# Altium schematic sheet Prefreals.SchDoc
size A4
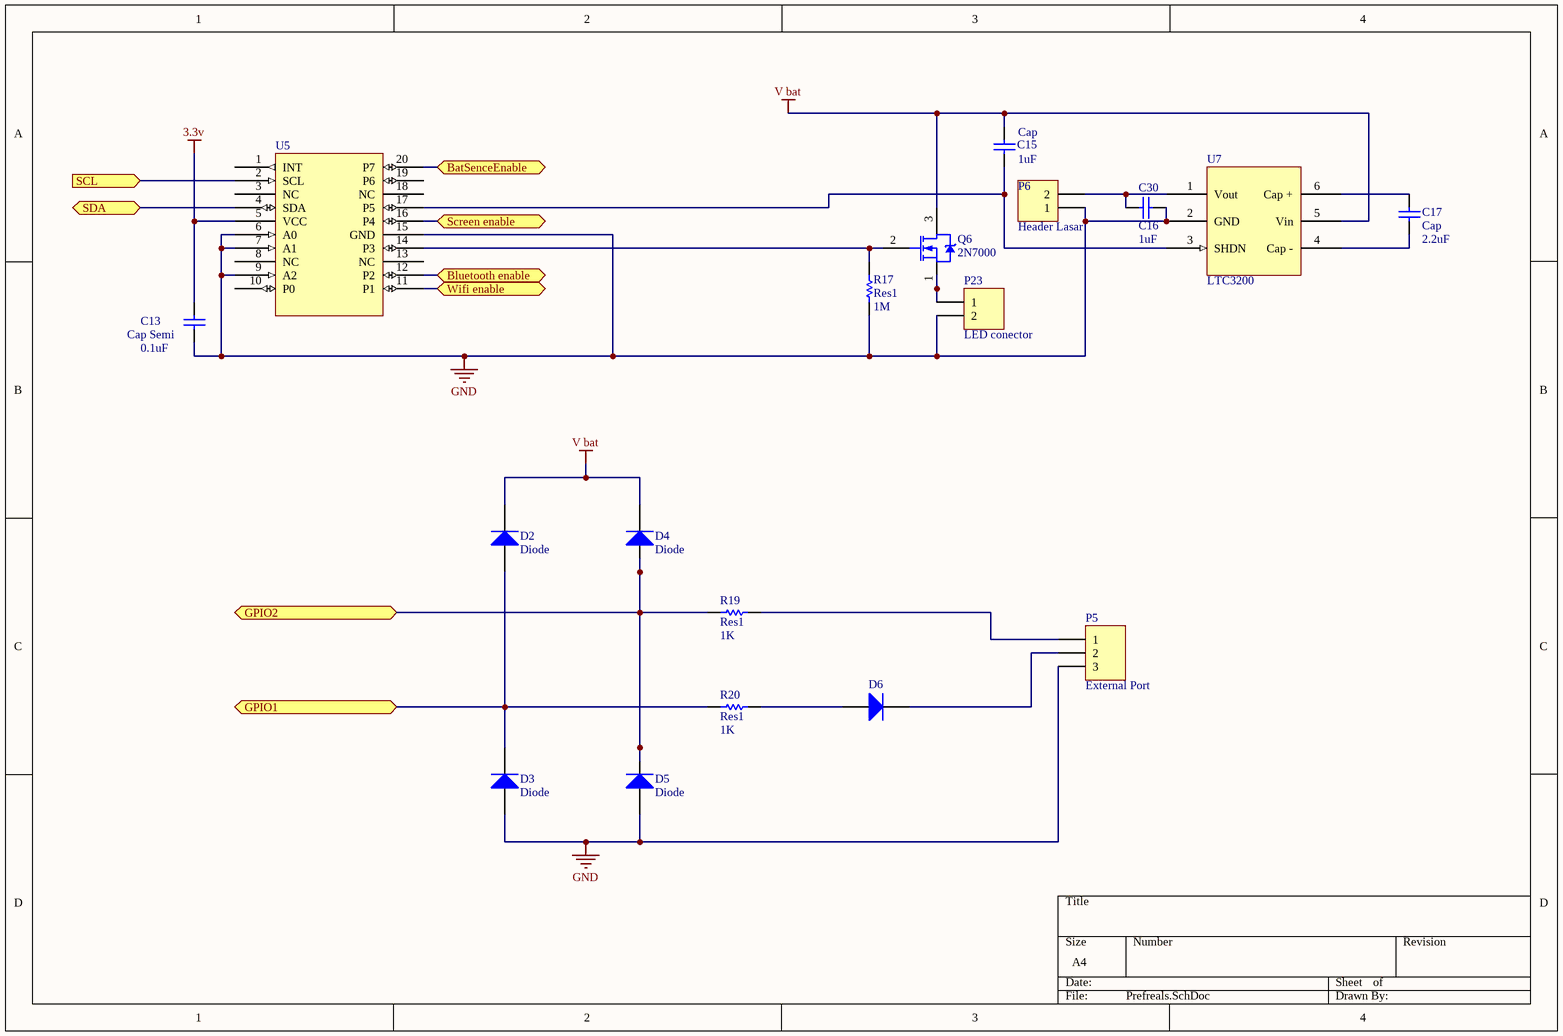
[diagram p0: Prefreals.SchDoc]

## Parts
C13  Cap Semi  value 0.1uF  [C1206]
C15  Cap  value 1uF  [J1-0603]
C17  Cap  value 2.2uF  [J1-0603]
C30  C16  value 1uF  [J1-0603]
D2  Diode  [J1-0603]
D3  Diode  [J1-0603]
D4  Diode  [J1-0603]
D5  Diode  [J1-0603]
D6  de ??  [J1-0603]  (value not drawn)
P5  External Port  [HDR1X3]
P6  Header Lasar  [HDR1X2]
P23  LED conector  [HDR1X2]
Q6  2N7000  [ONSC-SOT-323-3-419-04_V]
R17  Res1  value 1M  [0402]
R19  Res1  value 1K  [0402]
R20  Res1  value 1K  [0402]
U5  Component_1  [SOP20]  (value not drawn)
U7  LTC3200  [SOP6]

## Ports
BatSenceEnable (bidir), Bluetooth enable (bidir), GPIO1 (bidir), GPIO2 (bidir), SCL (in), Screen enable (bidir), SDA (bidir), Wifi enable (bidir)

## Nets
3.3v: C13.2 U5.5(VCC)
GND: C13.1 C30.2 D3.1(A) D5.1(A) P5.3 P6.1 P23.2 R17.1 U5.6(A0) U5.7(A1) U5.9(A2) U5.15(GND) U7.2(GND)
V bat: C15.2 D2.2(K) D4.2(K) Q6.3(D) U7.5(Vin)
BatSenceEnable: U5.20(P7) ; port BatSenceEnable
Bluetooth enable: U5.12(P2) ; port Bluetooth enable
GPIO1: D2.1(A) D3.2(K) R20.1 ; port GPIO1
GPIO2: D4.1(A) D5.2(K) R19.1 ; port GPIO2
SCL: U5.2(SCL) ; port SCL
Screen enable: U5.16(P4) ; port Screen enable
SDA: U5.4(SDA) ; port SDA
Wifi enable: U5.11(P1) ; port Wifi enable
NetC15_1: C15.1 U5.17(P5) U7.3(SHDN)
NetC17_1: C17.1 U7.4(Cap_-)
NetC17_2: C17.2 U7.6(Cap_+)
NetC30_1: C30.1 P6.2 U7.1(Vout)
NetD6_1: D6.1(A) R20.2
NetD6_2: D6.2(K) P5.2
NetP5_1: P5.1 R19.2
NetP23_1: P23.1 Q6.1(S)
NetQ6_2: Q6.2(G) R17.2 U5.14(P3)

Not connected (* = marked no-connect by the designer): U5 1(INT) 3(NC) 8(NC) 10(P0) 13(NC) 18(NC) 19(P6)

## Library data of the parts
C13 = Cap Semi: Capacitor (Semiconductor SIM Model); Published: 8-Jun-2000; LatestRevisionDate: 29-May-2009; LatestRevisionNote: IPC-7351 Footprint Added.; PackageReference: C1206; Publisher: Altium Limited; PackageDescription: Chip Capacitor
C15 C17 C30 = Cap: Capacitor; Published: 8-Jun-2000; LatestRevisionDate: 17-Jul-2002; LatestRevisionNote: Re-released for DXP Platform.; PackageReference: RAD-0.3; Publisher: Altium Limited; PackageDescription: Radial Cap, Thru-Hole; 2 Leads; 0.3 in Pin Spacing
D2-D6 = Diode: Default Diode; Published: 8-Jun-2000; LatestRevisionDate: 17-Jul-2002; LatestRevisionNote: Re-released for DXP Platform.; PackageVersion: Sep-1996; PackageReference: SMC; Publisher: Altium Limited; PackageDescription: DO-214-AB/SMC; 2 C-Bend Leads; Body 7.9 x 5.9 mm, inc. leads (LxW); Code_JEDEC: DO-214-AB
P5 = Header 3: Header, 3-Pin; LatestRevisionDate: 17-Jul-2002; LatestRevisionNote: Re-released for DXP Platform.; Publisher: Altium Limited
P6 P23 = Header 2: Header, 2-Pin; LatestRevisionDate: 17-Jul-2002; LatestRevisionNote: Re-released for DXP Platform.; Publisher: Altium Limited
Q6 = 2N7000: Small Signal MOSFET, 200 mA, 60 V, N-Channel, 3-Pin TO-92, Bulk Box; Manufacturer: On Semiconductor; Channel Polarity: N Channel; Ciss Typ (pF): 60; Configuration: Single; Coss Typ (pF): 25; Crss Typ (pF): 5; ID Max (A): 0.2; PD Max (W): 0.35; VGS Max (V): 20; VGS(th) Max (V): 3; DatasheetVersion: Rev. 8; PackageVersion: Rev. AM; PackageReference: TO-92-3-29-11_AM_SL; PackageDescription: 3-Pin Transistor Outline, Body 4.825 x 3.685 mm, Pitch 1.27 mm; Package Type: TO-92; Packing: Bulk Box; V(BR)DSS Min (V): 60; Mounting Technology: Through Hole; PartNumber: 2N7000; ComponentLink1Description: Manufacturer URL; ComponentLink1URL: http://www.onsemi.com/; ComponentLink2Description: Datasheet; ComponentLink2URL: http://www.onsemi.com/pub_link/Collateral/2N7000-D.PDF; ComponentLink3Description: Package Specification; ComponentLink3URL: http://www.onsemi.cn/pub_link/Collateral/2N6426-D.PDF
R17 R19 R20 = Res1: Resistor; Published: 8-Jun-2000; LatestRevisionDate: 17-Jul-2002; LatestRevisionNote: Re-released for DXP Platform.; PackageReference: AXIAL-0.3; Publisher: Altium Limited; PackageDescription: Axial Device, Thru-Hole; 2 Leads; 0.3 in Pin Spacing
U7 = Component_1